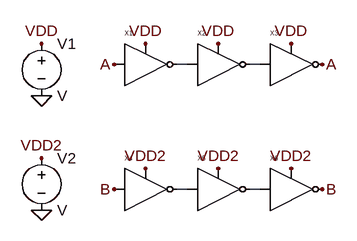
[diagram p0: schematic RINGOC_INV3.asc]
RINGOC_INV3.asc, the LTspice schematic file:
Version 4
SHEET 1 880 680
WIRE 48 112 32 112
WIRE 160 112 144 112
WIRE 48 304 32 304
WIRE 160 304 144 304
FLAG 256 112 A
FLAG -64 112 A
FLAG -16 80 VDD
FLAG 96 80 VDD
FLAG 208 80 VDD
FLAG 256 304 B
FLAG -64 304 B
FLAG -16 272 VDD2
FLAG 96 272 VDD2
FLAG 208 272 VDD2
FLAG -176 336 0
FLAG -176 160 0
FLAG -176 80 VDD
FLAG -176 256 VDD2
SYMBOL INVERTER_3_test -16 112 R0
SYMATTR InstName X1
SYMBOL INVERTER_3_test 96 112 R0
SYMATTR InstName X2
SYMBOL INVERTER_3_test 208 112 R0
SYMATTR InstName X3
SYMBOL INVERTER_3_test -16 304 R0
SYMATTR InstName X4
SYMBOL INVERTER_3_test 96 304 R0
SYMATTR InstName X5
SYMBOL INVERTER_3_test 208 304 R0
SYMATTR InstName X6
SYMBOL voltage -176 64 R0
SYMATTR InstName V1
SYMBOL voltage -176 240 R0
SYMATTR InstName V2

The netlist it stands for:
* RINGOC_INV3.asc
XX1 A N001 VDD INVERTER_3_test  ; pins IN OUT VDD
XX2 N001 N002 VDD INVERTER_3_test  ; pins IN OUT VDD
XX3 N002 A VDD INVERTER_3_test  ; pins IN OUT VDD
XX4 B N003 VDD2 INVERTER_3_test  ; pins IN OUT VDD
XX5 N003 N004 VDD2 INVERTER_3_test  ; pins IN OUT VDD
XX6 N004 B VDD2 INVERTER_3_test  ; pins IN OUT VDD
V1 VDD 0 V
V2 VDD2 0 V
.backanno
.end